# EAGLE schematic External Hookups (EAGLE 9.6.2)

## Sheet 1 of 2
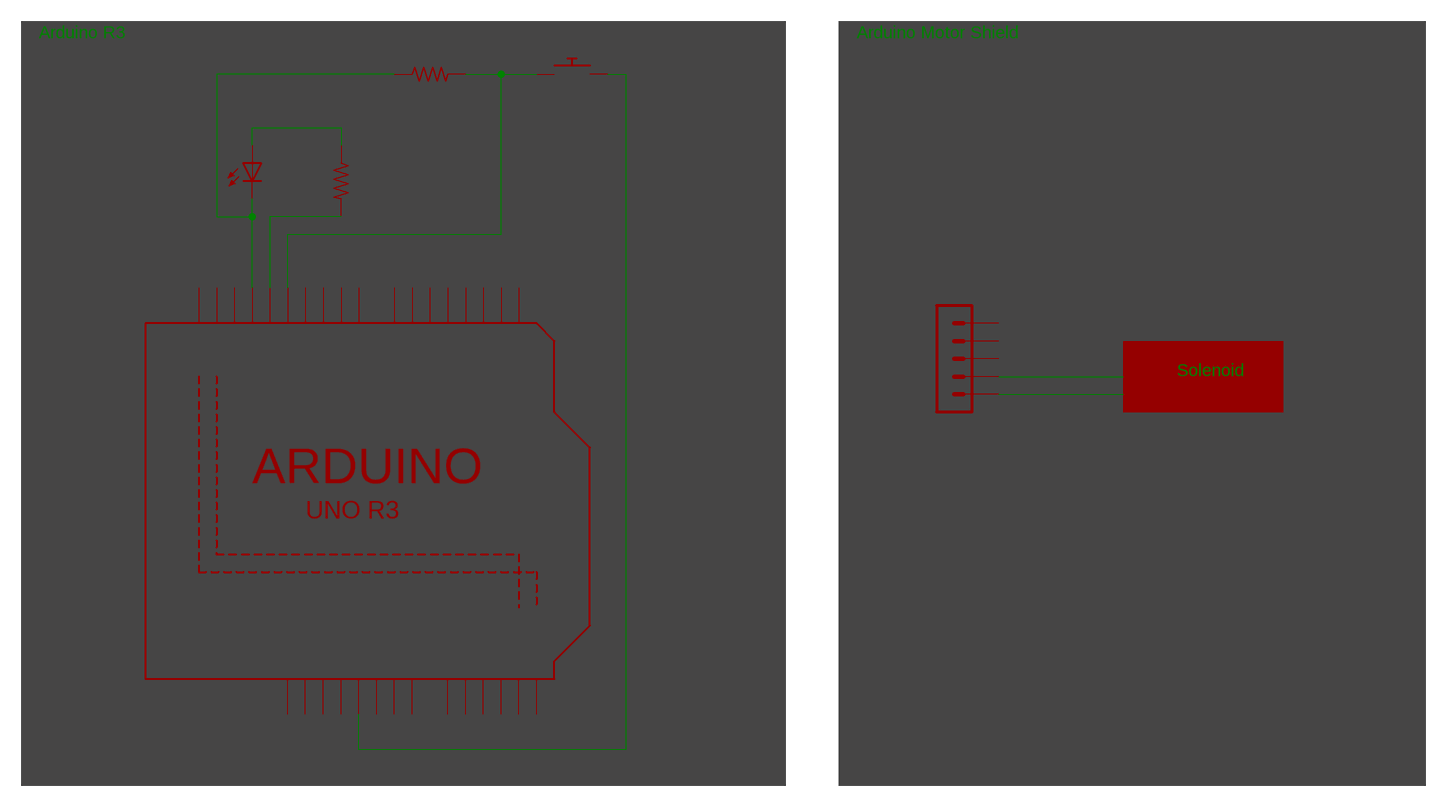
[diagram p0: schematic, sheet 1]

### Parts
LED5  LED  [SMARTLED-TTW]
M3/GND/M4  MA05-1  [MA05-1]
R3  1k  R-US_0204/2V  [0204V]
R4  10k  R-US_0204/2V  [0204V]
SW1  SWITCH_PUSHBUTTONEVQ-PE  [TACT_PANA-EVQ]
U1  ARDUINOR3-DIMENSION  [ARDUINOR3]

### Nets
N$1: LED5.C@1(C) R4.1 U1.GND
N$2: LED5.A@1(A) R3.1
N$3: R3.2 U1.D13
N$4: R4.2 SW1.P$1 U1.D12
N$5: SW1.P$2 U1.5V
PWM+: M3/GND/M4.1
PWM-: M3/GND/M4.2
Unconnected: M3/GND/M4.3 M3/GND/M4.4 M3/GND/M4.5 U1.A0 U1.A1 U1.A2 U1.A3 U1.A4(A4/SDA) U1.A5(A5/SCL) U1.AREF U1.D0 U1.D1 U1.D2 U1.D3 U1.D4 U1.D5 U1.D6 U1.D7 U1.D8 U1.D9 U1.D10 U1.D11 U1.IOREF U1.RESERVED U1.RESET(/RESET) U1.SCL U1.SDA

### Notes on the sheet
- Arduino R3 | Arduino Motor Shield
- Solenoid

## Sheet 2 of 2
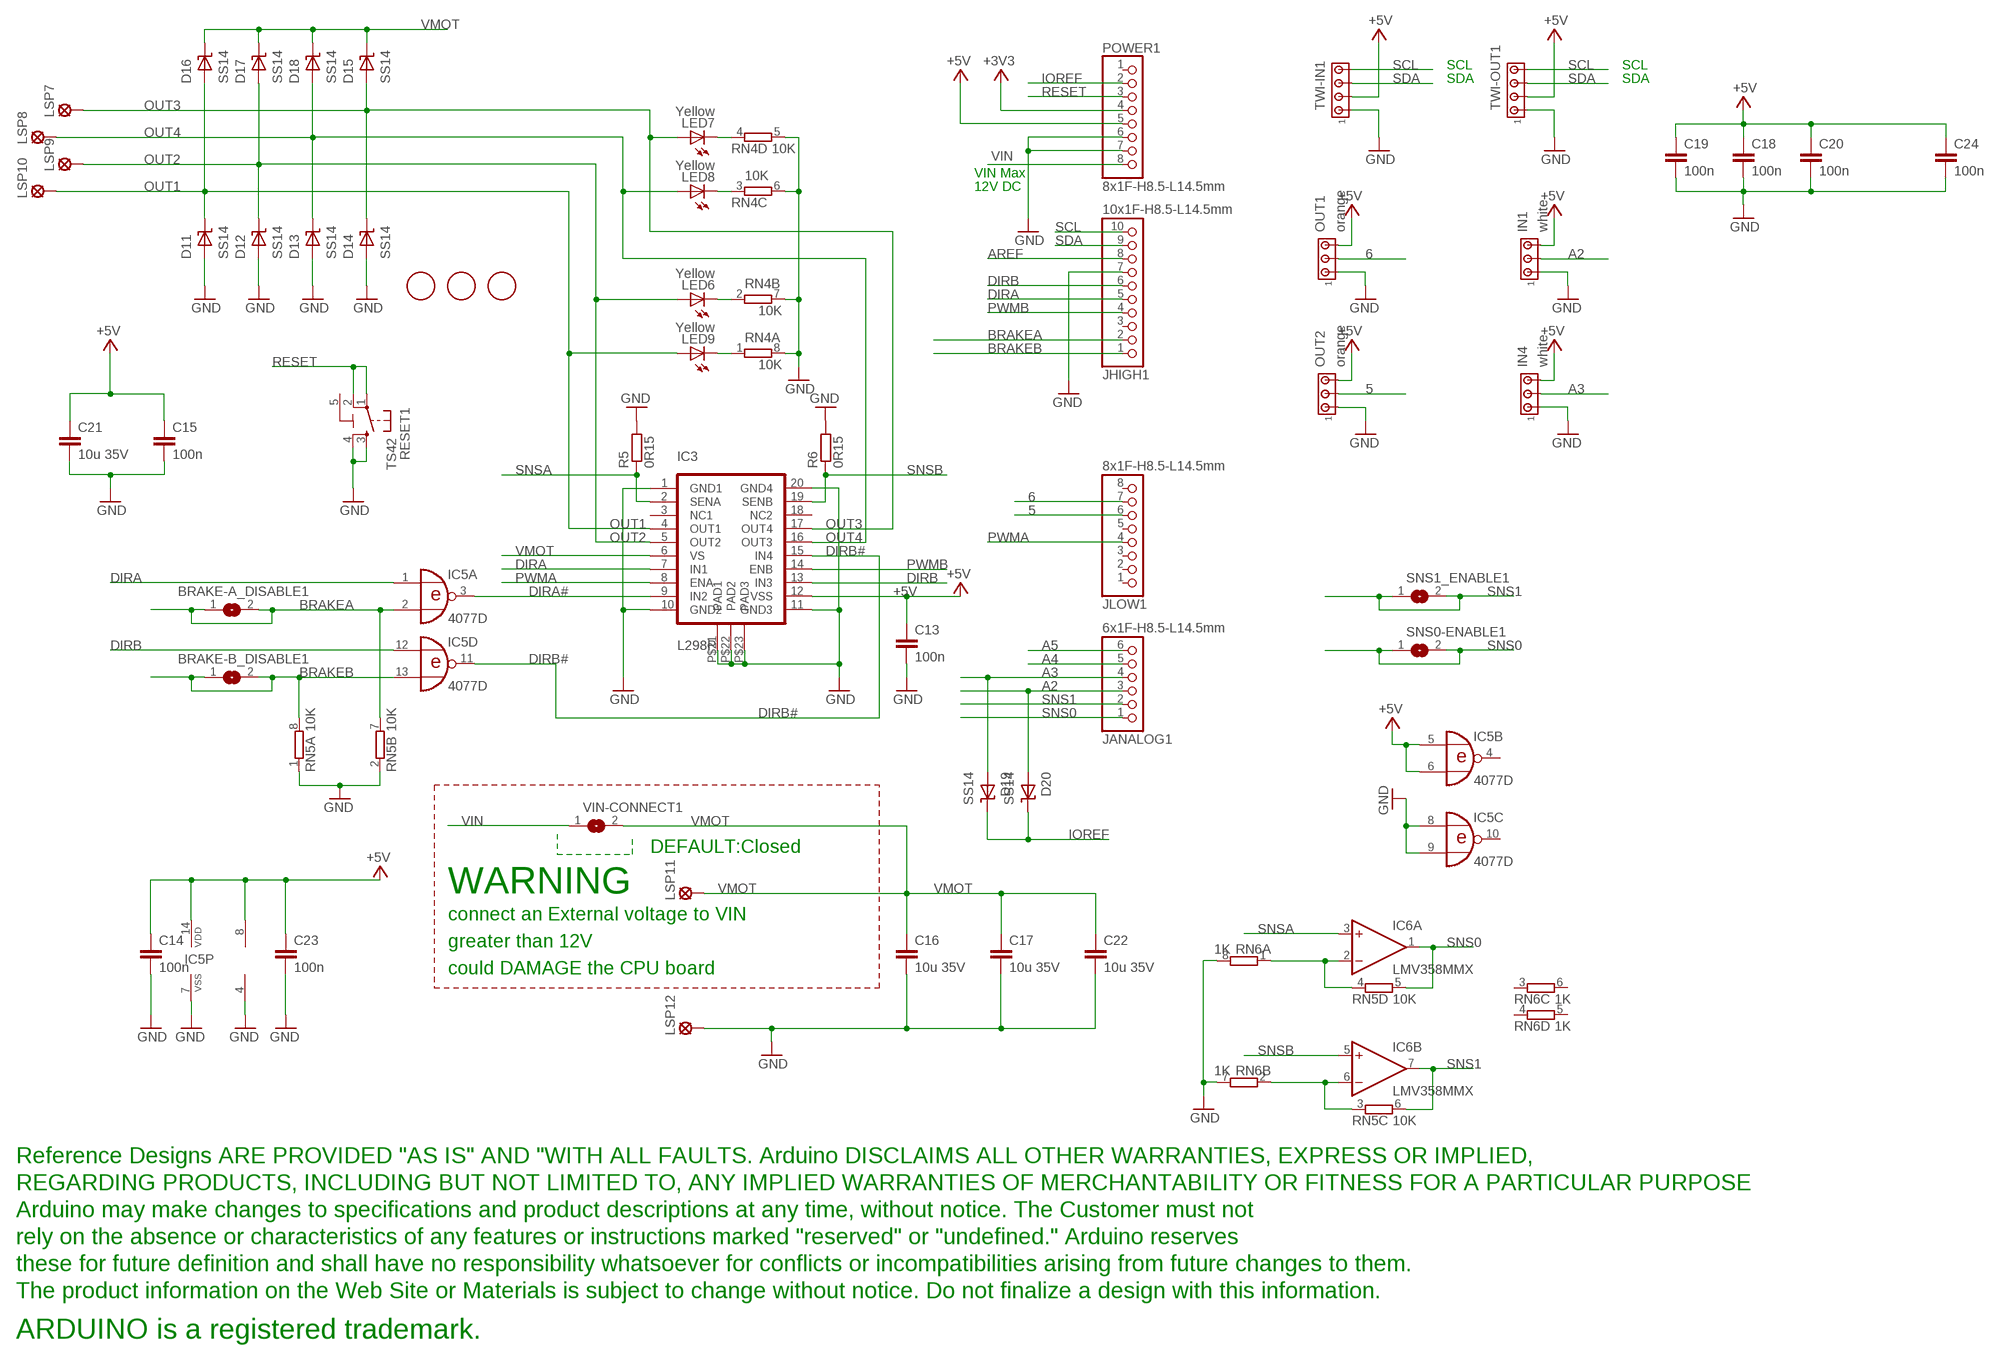
[diagram p1: schematic, sheet 2]

### Parts
BRAKE-A_DISABLE1  SJ  [SJ]
BRAKE-B_DISABLE1  SJ  [SJ]
C13  100n  C-EUC0603  [C0603-ROUND]
C14  100n  C-EUC0603  [C0603-ROUND]
C15  100n  C-EUC0603  [C0603-ROUND]
C16  10u 35V  C-EUC1210  [C1210]
C17  10u 35V  C-EUC1210  [C1210]
C18  100n  C-EUC0603  [C0603-ROUND]
C19  100n  C-EUC0603  [C0603-ROUND]
C20  100n  C-EUC0603  [C0603-ROUND]
C21  10u 35V  C-EUC1210  [C1210]
C22  10u 35V  C-EUC1210  [C1210]
C23  100n  C-EUC0603  [C0603-ROUND]
C24  100n  C-EUC0603  [C0603-ROUND]
D11  SS14  [SMA]
D12  SS14  [SMA]
D13  SS14  [SMA]
D14  SS14  [SMA]
D15  SS14  [SMA]
D16  SS14  [SMA]
D17  SS14  [SMA]
D18  SS14  [SMA]
D19  SS14  [SMA]
D20  SS14  [SMA]
FID4  FIDUCIALMOUNT  [FIDUCIA-MOUNT]
FID5  FIDUCIALMOUNT  [FIDUCIA-MOUNT]
FID6  FIDUCIALMOUNT  [FIDUCIA-MOUNT]
IC3  L298P  [POWER-SO20]
IC5  4077D  [SO14]
IC6  LMV358MMX  [MSOP08]
IN1  white  MTA03-100  [10X03MTA]
IN4  white  MTA03-100  [10X03MTA]
JANALOG1  6x1F-H8.5-L14.5mm  PINHD-1X6TH  [1X06-TH]
JHIGH1  10x1F-H8.5-L14.5mm  PINHD-1X10TH  [1X10-TH]
JLOW1  8x1F-H8.5-L14.5mm  PINHD-1X8TH  [1X08-TH]
LED6  Yellow  LEDCHIPLED_0805  [CHIPLED_0805]
LED7  Yellow  LEDCHIPLED_0805  [CHIPLED_0805]
LED8  Yellow  LEDCHIPLED_0805  [CHIPLED_0805]
LED9  Yellow  LEDCHIPLED_0805  [CHIPLED_0805]
LSP7  LSP13  [LSP13]
LSP8  LSP13  [LSP13]
LSP9  LSP13  [LSP13]
LSP10  LSP13  [LSP13]
LSP11  LSP13  [LSP13]
LSP12  LSP13  [LSP13]
OUT1  orange  MTA03-100  [10X03MTA]
OUT2  orange  MTA03-100  [10X03MTA]
POWER1  8x1F-H8.5-L14.5mm  PINHD-1X8TH  [1X08-TH]
R5  0R15  R-EU_R1206  [R1206]
R6  0R15  R-EU_R1206  [R1206]
RESET1  TS42  [TS42]
RN4  10K  4R-NCAY16  [CAY16]
RN5  10K  4R-NCAY16  [CAY16]
RN6  1K  4R-NCAY16  [CAY16]
SNS0-ENABLE1  SJ  [SJ]
SNS1_ENABLE1  SJ  [SJ]
TWI-IN1  MTA04-100  [10X04MTA]
TWI-OUT1  MTA04-100  [10X04MTA]
U$2  DISCLAIMER  [DISCLAIMER]
VIN-CONNECT1  SJ  [SJ]

### Nets
5: JLOW1.6 OUT2.2
6: JLOW1.7 OUT1.2
+3V3 [power]: POWER1.4
+5V [power]: C13.1 C14.1 C15.1 C18.1 C19.1 C20.1 C21.1 C23.1 C24.1 IC3.P$12(VSS) IC5.5(B:I0) IC5.6(B:I1) IC5.14(P:VDD) IC6.8(P:V+) IN1.3 IN4.3 OUT1.3 OUT2.3 POWER1.5 TWI-IN1.2 TWI-OUT1.2
A2: D20.P$2(A) IN1.2 JANALOG1.3
A3: D19.P$2(A) IN4.2 JANALOG1.4
A4: JANALOG1.5
A5: JANALOG1.6
AREF: JHIGH1.8
BRAKEA: BRAKE-A_DISABLE1.1 BRAKE-A_DISABLE1.2 IC5.2(A:I1) JHIGH1.2 RN5.7
BRAKEB: BRAKE-B_DISABLE1.1 BRAKE-B_DISABLE1.2 IC5.13(D:I1) JHIGH1.1 RN5.8
DIRA: IC3.P$7(IN1) IC5.1(A:I0) JHIGH1.5
DIRA#: IC3.P$9(IN2) IC5.3(A:O)
DIRB: IC3.P$13(IN3) IC5.12(D:I0) JHIGH1.6
DIRB#: IC3.P$15(IN4) IC5.11(D:O)
GND [power]: C13.2 C14.2 C15.2 C16.2 C17.2 C18.2 C19.2 C20.2 C21.2 C22.2 C23.2 C24.2 D11.P$2(A) D12.P$2(A) D13.P$2(A) D14.P$2(A) IC3.P$1(GND1) IC3.P$10(GND2) IC3.P$11(GND3) IC3.P$20(GND4) IC3.P$21(PAD1) IC3.P$22(PAD2) IC3.P$23(PAD3) IC5.7(P:VSS) IC5.8(C:I0) IC5.9(C:I1) IC6.4(P:V-) IN1.1 IN4.1 JHIGH1.7 LSP12.MP OUT1.1 OUT2.1 POWER1.6 POWER1.7 R5.2 R6.2 RESET1.3 RESET1.4 RN4.5 RN4.6 RN4.7 RN4.8 RN5.1 RN5.2 RN6.7 RN6.8 TWI-IN1.1 TWI-OUT1.1
IOREF: D19.P$1(K) D20.P$1(K) POWER1.2
N$53: LED7.C RN4.4
N$54: LED8.C RN4.3
N$55: LED6.C RN4.2
N$56: LED9.C RN4.1
N$57: IC6.2(A:-IN) RN5.4 RN6.1
N$58: IC6.6(B:-IN) RN5.3 RN6.2
OUT1: D11.P$1(K) D16.P$2(A) IC3.P$4(OUT1) LED9.A LSP10.MP
OUT2: D12.P$1(K) D17.P$2(A) IC3.P$5(OUT2) LED6.A LSP9.MP
OUT3: D14.P$1(K) D15.P$2(A) IC3.P$17(OUT4) LED7.A LSP7.MP
OUT4: D13.P$1(K) D18.P$2(A) IC3.P$16(OUT3) LED8.A LSP8.MP
PWMA: IC3.P$8(ENA) JLOW1.4
PWMB: IC3.P$14(ENB) JHIGH1.4
RESET: POWER1.3 RESET1.1 RESET1.2
SCL: JHIGH1.10 TWI-IN1.4 TWI-OUT1.4
SDA: JHIGH1.9 TWI-IN1.3 TWI-OUT1.3
SNS0: IC6.1(A:OUT) JANALOG1.1 RN5.5 SNS0-ENABLE1.1 SNS0-ENABLE1.2
SNS1: IC6.7(B:OUT) JANALOG1.2 RN5.6 SNS1_ENABLE1.1 SNS1_ENABLE1.2
SNSA: IC3.P$2(SENA) IC6.3(A:+IN) R5.1
SNSB: IC3.P$19(SENB) IC6.5(B:+IN) R6.1
VIN [VIN]: POWER1.8 VIN-CONNECT1.1
VMOT: C16.1 C17.1 C22.1 D15.P$1(K) D16.P$1(K) D17.P$1(K) D18.P$1(K) IC3.P$6(VS) LSP11.MP VIN-CONNECT1.2
Unconnected: IC3.P$3(NC1) IC3.P$18(NC2) IC5.4(B:O) IC5.10(C:O) JHIGH1.3 JLOW1.1 JLOW1.2 JLOW1.3 JLOW1.5 JLOW1.8 POWER1.1 RN6.3 RN6.4 RN6.5 RN6.6

### Notes on the sheet
- SCL | SCL
- SDA | SDA
- VIN Max
- 12V DC
- DEFAULT:Closed
- WARNING
- connect an External voltage to VIN
- greater than 12V
- could DAMAGE the CPU board

## Power pins joined to a net without a drawn wire
3V: U1.3V
5-GND: RESET1.5(5-GND)
GND1: U1.GND1
GND2: U1.GND2
VIN: U1.VIN

## Library data of the parts
BRAKE-A_DISABLE1 BRAKE-B_DISABLE1 SNS0-ENABLE1 SNS1_ENABLE1 VIN-CONNECT1 = jumper:SJ: SMD solder JUMPER
C13-C24 = SmartPrj:C-EU: CAPACITOR, European symbol
D11-D20 = SmartPrj:SS14: DIODE SS14 Diode Schottky 1A 40v
FID4-FID6 = SmartPrj:FIDUCIALMOUNT
IC3 = SmartPrj:L298P: L298P DUAL FUL-BRIDGE DRIVER PowerSO20
IC5 = 40xx:4077: Quad XNOR
IC6 = linear:LMV358?*: Dual General Purpose, Low Voltage, Rail-to-Rail Output Operational Amplifiers Source: http://www.national.com/mpf/LM/LMV321.html http://www.national.com/dt/lmv_qual.pdf
IN1 IN4 OUT1 OUT2 = SmartPrj:MTA03-100: PIN HEADER; OC_FARNELL: unknown; OC_NEWARK: unknown
JANALOG1 = SmartPrj:PINHD-1X6: PIN HEADER
JHIGH1 = SmartPrj:PINHD-1X10: PIN HEADER
JLOW1 POWER1 = SmartPrj:PINHD-1X8: PIN HEADER
LED5 = adafruit:LED: LED
LED6-LED9 = led:LED: LED
LSP7-LSP12 = solpad:LSP13: SOLDER PAD drill 1.3 mm, distributor Buerklin, 12H562
M3/GND/M4 = con-lstb:MA05-1: PIN HEADER; OC_FARNELL: unknown; OC_NEWARK: unknown
R3 R4 = adafruit:R-US_: RESISTOR, American symbol
R5 R6 = SmartPrj:R-EU_: RESISTOR, European symbol
RESET1 = SmartPrj:TS42: TS42 Dongnan Electronics Tact switch VDC 12V - 50mA
RN4-RN6 = resistor-dil:4R-N: Array Chip Resistor Source: RS Component / Phycomp
SW1 = adafruit:SWITCH_PUSHBUTTON: Buttons SOFTTOUCHSMD_SJ - Soft touch temporary push button (Super Junk Akihabara) Compatible with SKPMANE010 [Mouser: 688-SKPMAN] C&K_KSS = Digikey: KSS221GLFS
TWI-IN1 TWI-OUT1 = con-amp:MTA04-100: AMP connector
U1 = adafruit:ARDUINOR3: This is a new object for the new Arduino R3 - with extra pins that you may want to use (such as IOref, and duplicated A4/A5
U$2 = SmartPrj:DISCLAIMER

## Net classes
0 default: width 0.406 mm, drill 0.61 mm, clearance 0.152 mm
1 power: width 0.406 mm, drill 0.61 mm, clearance 0.152 mm
2 VIN: width 0.406 mm, drill 0.61 mm, clearance 0.152 mm